# Altium schematic sheet EEPROM.SchDoc
size A4; SheetNumber: 3; SheetTotal: 4
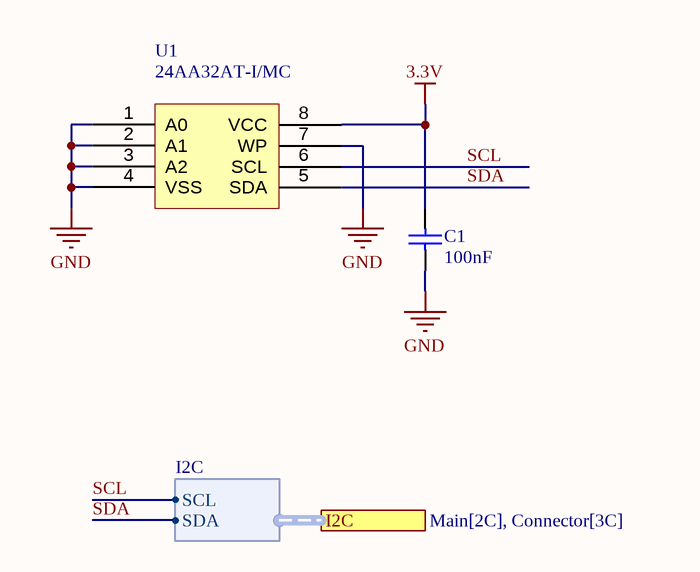
[diagram p0: EEPROM.SchDoc]

## Parts
C1  100nF  [Capacitor 0201]
U1  24AA32AT-I/MC  [TDFN-8 2x3mm]

## Ports
I2C (harness I2C, see Main[2C], Connector[3C])

## Harnesses
I2C: SCL, SDA

## Nets
3.3V: C1.2 U1.8(VCC)
GND: C1.1 U1.1(A0) U1.2(A1) U1.3(A2) U1.4(VSS) U1.7(WP)
SCL: U1.6(SCL) ; port I2C.SCL
SDA: U1.5(SDA)

## Notes on the sheet
- TITLE
- SIZE
- A4
- VARIANT
- PROJECT
- SHEET
- VERSION
- OF
- AUTHOR
- DATE

## Library data of the parts
C1 = Capacitor
U1 = 24AA32A